# EAGLE board untitled (EAGLE 9.3.0)
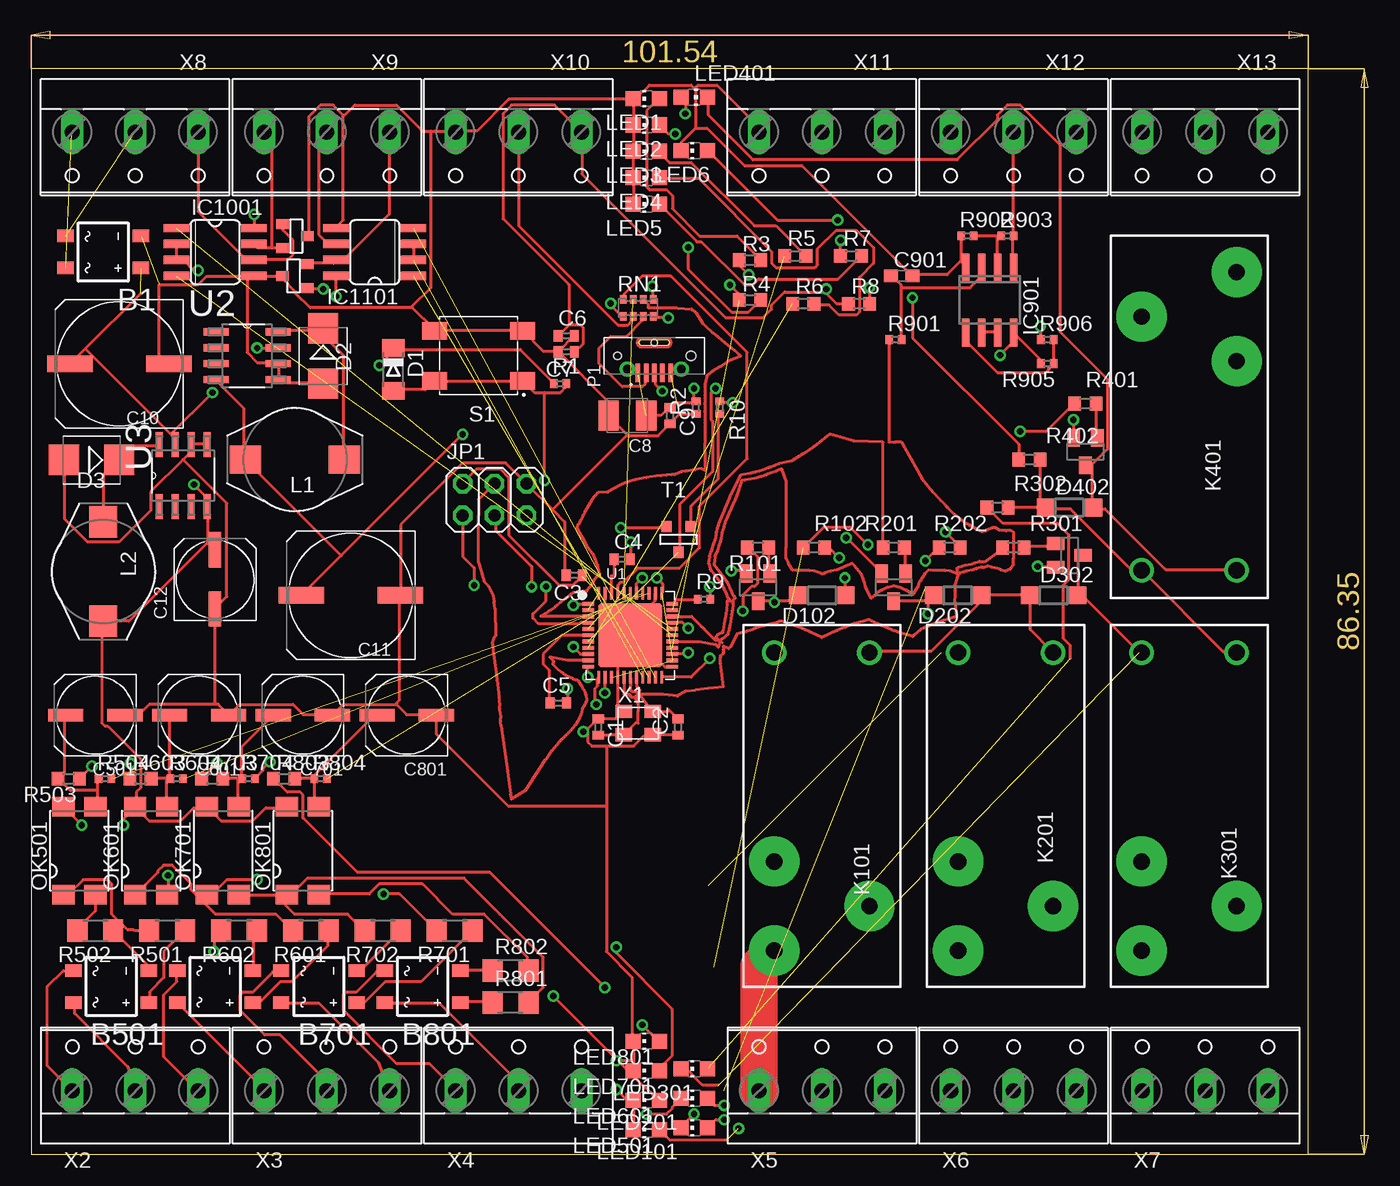
[diagram p8: board, top side]
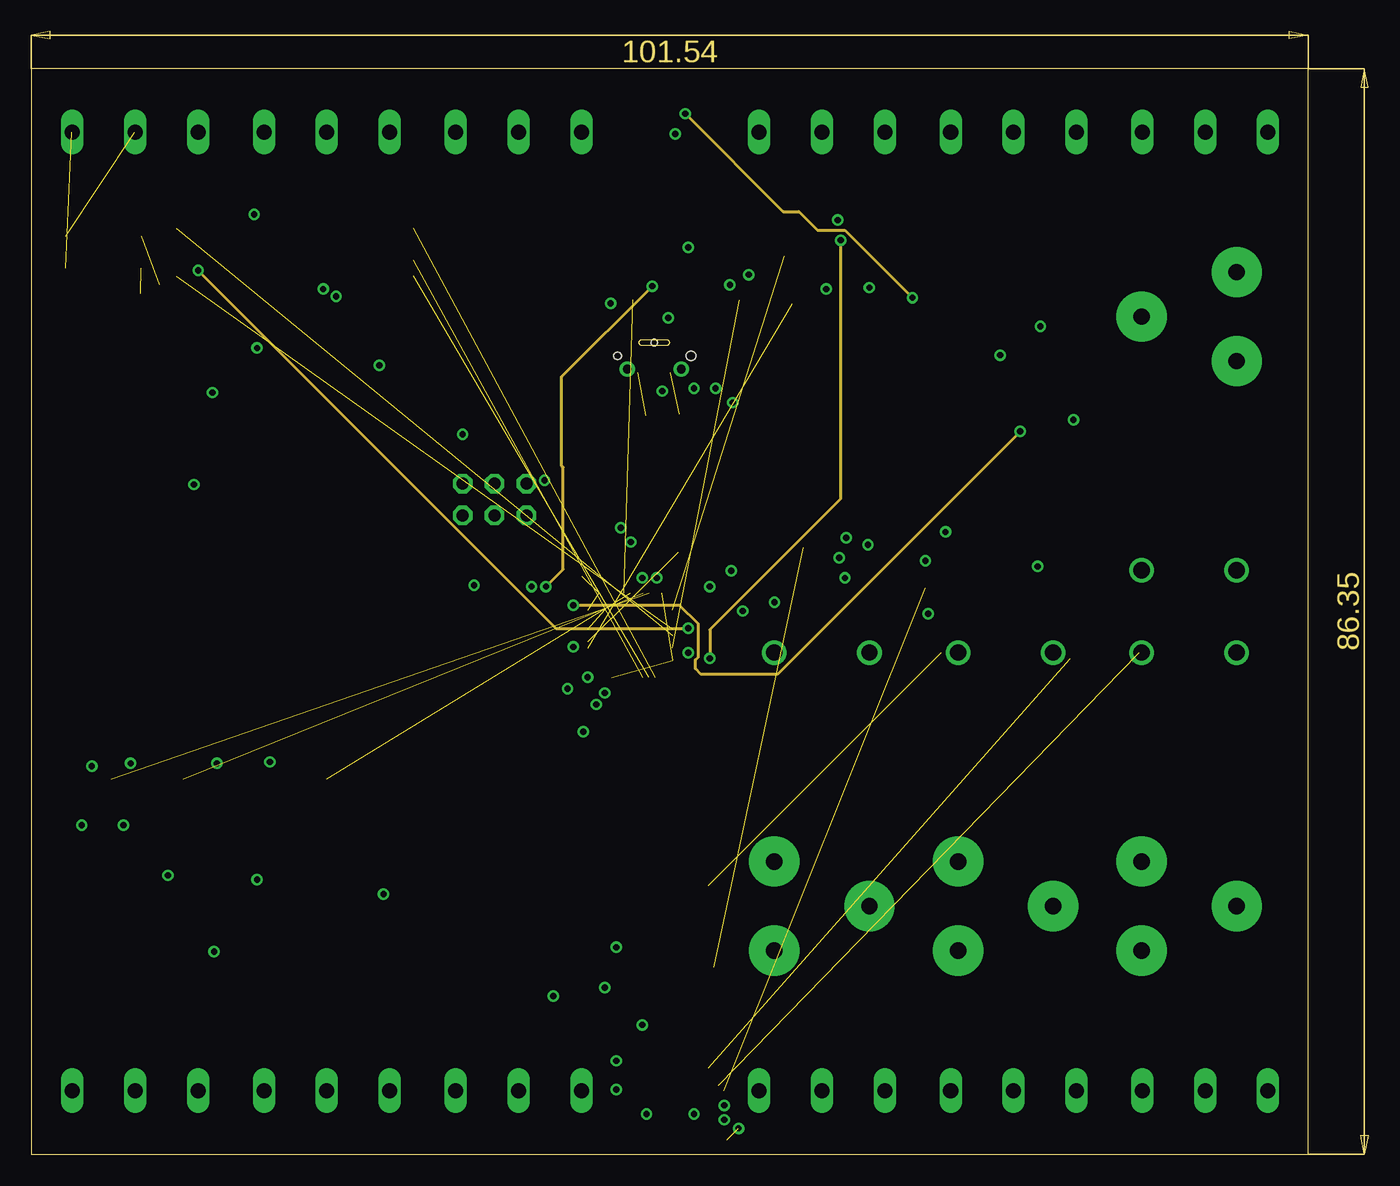
[diagram p9: board, inner layer Route2]
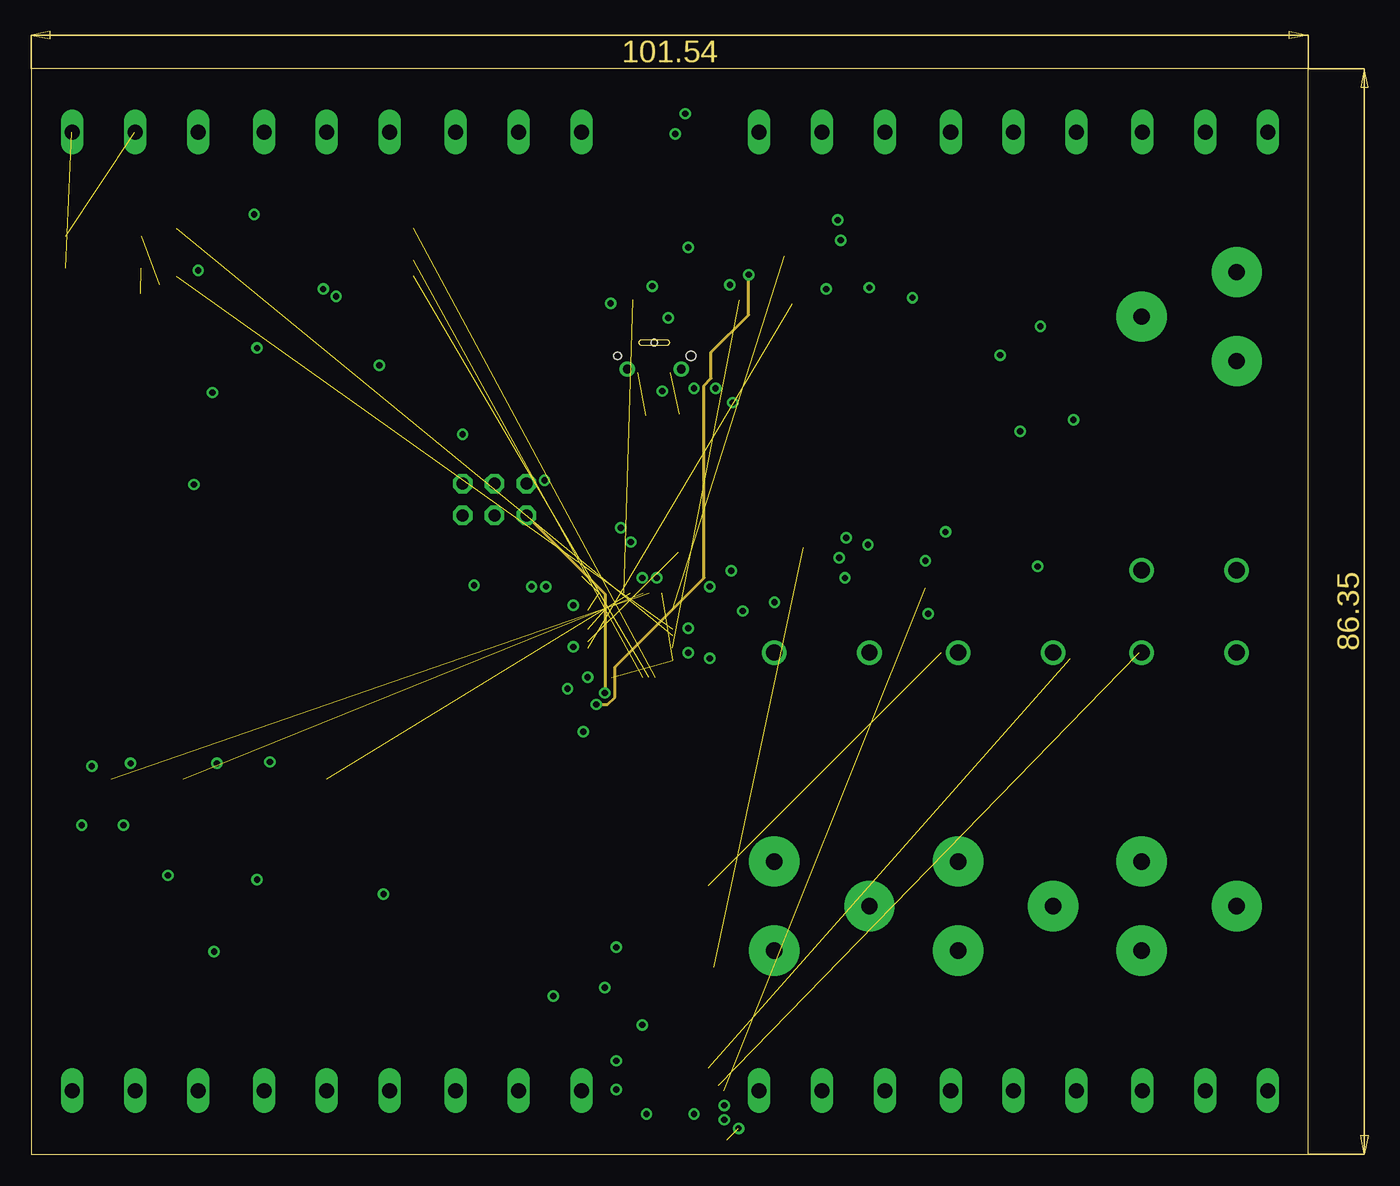
[diagram p10: board, inner layer Route15]
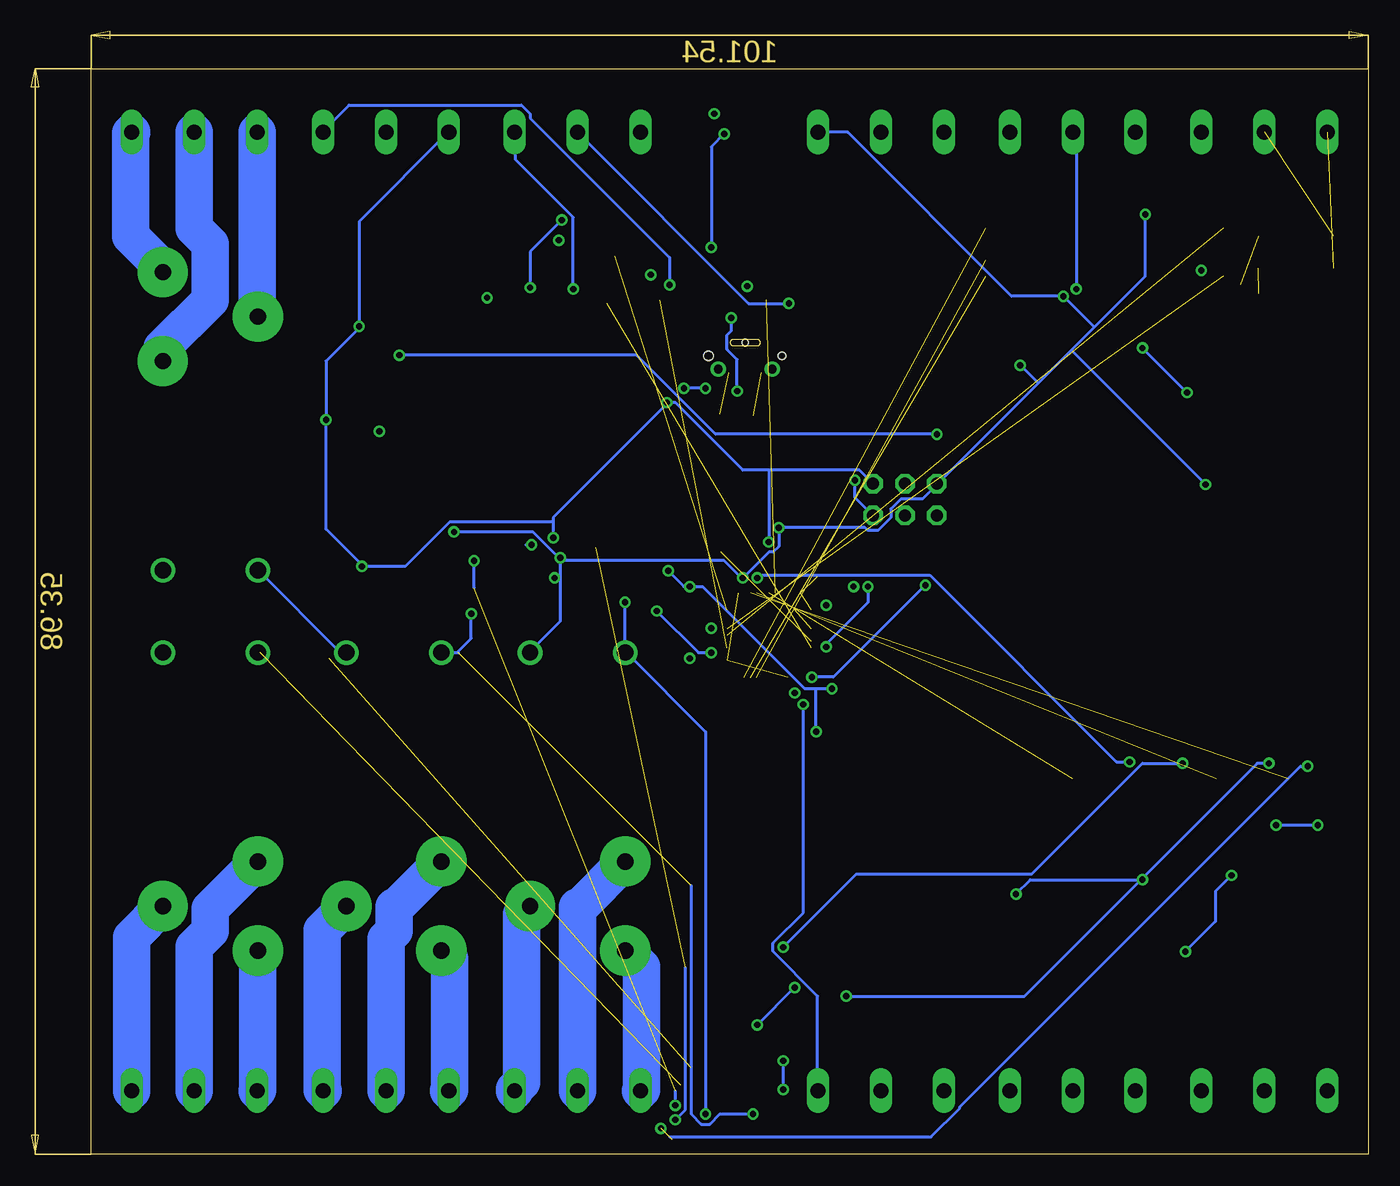
[diagram p11: board, bottom side, seen from below]

Size 101.54 x 86.35 mm. Coordinates in mm from the lower left corner, seen from the top.
Outline: 0,0 101.54,0 101.54,86.35 0,86.35 0,0
Copper layers (1+2*15+16): Top 0.035mm / dielectric 1.5mm / Route2 0.035mm / dielectric 0.15mm / Route15 0.035mm / dielectric 0.2mm / Bottom 0.035mm
Design rules "default *": minimum track width 6mil, minimum drill 0.35mm, track to track 6mil, track to pad 6mil, pad to pad 6mil, via to via 6mil, smd to smd 6mil, copper to edge 40mil, drill to drill 6mil, minimum pad ring 10mil, minimum via ring 8mil, stop-mask expansion 4mil, vias tented up to drill 0mil, thermal gap 10mil
Net classes: 0 default: width 0.254 mm, drill 0.5 mm, clearance 0.203 mm; 1 hipower: width 3 mm, drill 1 mm, clearance 0.254 mm; 2 power: width 0.508 mm, drill 0.013 mm, clearance 0.203 mm

## Footprints (pad centres in the part's own frame; a part is rotated, then mirrored left to right if it is on the bottom)
MBS = smd 1 x 1.3: + -1.27,-3; - 1.27,-3; AC1 -1.27,3; AC2 1.27,3
C0402 = smd 0.7 x 0.9: 1 -0.65,0; 2 0.65,0
SMC_B = smd 1.6 x 2.4: + -1.5,0; - 1.5,0
UD-10X10_NICHICON = smd 3.6 x 1.3: + 3.925,0; - -3.95,0
UD-6,3X5,8_NICHICON = smd 2.8 x 1: + 2.35,0; - -2.35,0
C0603 = smd 1.1 x 1: 1 -0.85,0; 2 0.85,0
MINIMELF = smd 1.4 x 1.8: A 1.7,0; C -1.7,0
SMB = smd 2.4 x 2.4: A 2.2,0; C -2.2,0
SOD123 = smd 1.4 x 1.4: A 1.9,0; C -1.9,0
SOT-23-3 = smd 0.802 x 0.972: 1 -0.95,-1; 2 0.95,-1; 3 0,1
SO08 = smd 0.6 x 2.2: 1 -1.905,-2.6; 2 -0.635,-2.6; 3 0.635,-2.6; 4 1.905,-2.6; 5 1.905,2.6; 6 0.635,2.6; 7 -0.635,2.6; 8 -1.905,2.6
SO08' = smd 0.66 x 2.032: 1 -1.905,-3.073; 2 -0.635,-3.073; 3 0.635,-3.073; 4 1.905,-3.073; 5 1.905,3.073; 6 0.635,3.073; 7 -0.635,3.073; 8 -1.905,3.073
2X03 = drill 0.95 pad 1.55 octagon: 1 -2.54,-1.27; 2 -2.54,1.27; 3 0,-1.27; 4 0,1.27; 5 2.54,-1.27; 6 2.54,1.27
RT-C/O12A3.5 = drill 1.3 pad 4: 11 7.56,3.78; 12 4.02,-3.78; 14 11.1,-3.78 | drill 1.3: A1 -12.6,-3.78; A2 -12.6,3.78
BOURNS_SRR0805 = smd 2.5 x 2.2: 1 -3.95,0; 2 3.95,0
CHIP-LED0805 = smd 1.2 x 1.2: A 0,-1.05; C 0,1.05
SMD4 = smd 1.78 x 1.55: 1 -1.27,-3.5; 2 1.27,-3.5; 3 1.27,3.5; 4 -1.27,3.5
KYCON_KMMVX-SMT-BS-BTR = smd 0.45 x 1.5: 1 -1.3,-1.35; 2 -0.65,-1.35; 3 0,-1.35; 4 0.65,-1.35; 5 1.3,-1.35 | drill 0.7 pad 1: P1 -2.15,-1.05; P2 2.15,-1.05 | smd 0.1 x 0.1: P3 -1.3,1.05 | hole 0.6: -2.925,0 | hole 0.75: 2.925,0 | hole 0.5: 0,1.05
BSS138L = smd 1 x 1.4: D 0,1.1; G -0.95,-1.1; S 0.95,-1.1
R0402 = smd 0.6 x 0.7: 1 -0.5,0; 2 0.5,0
R0603 = smd 1 x 1.1: 1 -0.85,0; 2 0.85,0
R1206 = smd 1.6 x 1.803: 1 -1.422,0; 2 1.422,0
CAY16 = smd 0.5 x 0.65: 1 -1.2,-0.675; 2 -0.4,-0.675; 3 0.4,-0.675; 4 1.2,-0.675; 5 1.2,0.675; 6 0.4,0.675; 7 -0.4,0.675; 8 -1.2,0.675
430481035816 = smd 2 x 1.4: 1 -3.5,2; 2 3.5,2; 3 -3.5,-2; 4 3.5,-2
SOT-23 = smd 0.787 x 0.889: 1 0.025,-1.016; 2 -0.94,1.016; 3 0.991,1.016
QFN44G-0.5-7X7MM = smd 1 x 0.3: 1 -3.35,2.5; 2 -3.35,2; 3 -3.35,1.5; 4 -3.35,1; 5 -3.35,0.5; 6 -3.35,0; 7 -3.35,-0.5; 8 -3.35,-1; 9 -3.35,-1.5; 10 -3.35,-2; 11 -3.35,-2.5; 23 3.35,-2.5; 24 3.35,-2; 25 3.35,-1.5; 26 3.35,-1; 27 3.35,-0.5; 28 3.35,0; 29 3.35,0.5; 30 3.35,1; 31 3.35,1.5; 32 3.35,2; 33 3.35,2.5 | smd 0.3 x 1: 12 -2.5,-3.35; 13 -2,-3.35; 14 -1.5,-3.35; 15 -1,-3.35; 16 -0.5,-3.35; 17 0,-3.35; 18 0.5,-3.35; 19 1,-3.35; 20 1.5,-3.35; 21 2,-3.35; 22 2.5,-3.35; 34 2.5,3.35; 35 2,3.35; 36 1.5,3.35; 37 1,3.35; 38 0.5,3.35; 39 0,3.35; 40 -0.5,3.35; 41 -1,3.35; 42 -1.5,3.35; 43 -2,3.35; 44 -2.5,3.35 | smd 5.08 x 5.08: TAB 0,0
SOIC127P620X175-8N = smd 1.981 x 0.559: 1 -2.464,1.905; 2 -2.464,0.635; 3 -2.464,-0.635; 4 -2.464,-1.905; 5 2.464,-1.905; 6 2.464,-0.635; 7 2.464,0.635; 8 2.464,1.905
CRYSTAL-3.2-2.5 = smd 1.3 x 1.05: 1 -1.15,-0.925; 2 1.15,-0.925; 3 1.15,0.925; 4 -1.15,0.925
W237-103 = drill 1.194 long: 1 -5,-1.29; 2 0,-1.29; 3 5,-1.29

## Placement (x,y rotation side)
B1  B6S  [MBS]  5.71,71.75 90 top
B501  B6S  [MBS]  6.35,13.34 90 top
B601  B6S  [MBS]  14.61,13.34 90 top
B701  B6S  [MBS]  22.86,13.34 90 top
B801  B6S  [MBS]  31.11,13.34 90 top
C1  22pF  [C0402]  45.07,33.98 270 top
C2  22pF  [C0402]  51.42,33.98 90 top
C3  1uF  [C0402]  43.16,46.05 180 top
C4  100n  [C0402]  46.98,47.31 0 top
C5  1uF  [C0402]  41.9,35.88 0 top
C6  100n  [C0402]  42.53,65.09 0 top
C7  100n  [C0402]  42.53,63.83 180 top
C8  22u  [SMC_B]  47.4,58.74 180 top
C9  100n  [C0402]  50.78,58.74 270 top
C10  220uFx35V  [UD-10X10_NICHICON]  6.99,62.87 180 top
C11  220uFx35V  [UD-10X10_NICHICON]  25.4,44.45 180 top
C12  220uFx10  [UD-6,3X5,8_NICHICON]  14.61,45.72 90 top
C501  100uFx6,3  [UD-6,3X5,8_NICHICON]  5.08,34.92 180 top
C601  100uFx6,3  [UD-6,3X5,8_NICHICON]  13.34,34.92 180 top
C701  100uFx6,3  [UD-6,3X5,8_NICHICON]  21.59,34.92 180 top
C801  100uFx6,3  [UD-6,3X5,8_NICHICON]  29.84,34.92 180 top
C901  0.1uF  [C0603]  69.22,69.85 0 top
D1  CD1206-S01575  [MINIMELF]  28.78,62.41 270 top
D2  MBRS130LT3  [SMB]  23.2,63.48 270 top
D3  MBRS130LT3  [SMB]  4.79,55.23 180 top
D102  MBR0520LT  [SOD123]  62.87,44.45 180 top
D202  MBR0520LT  [SOD123]  73.66,44.45 180 top
D302  MBR0520LT  [SOD123]  81.28,44.45 0 top
D402  MBR0520LT  [SOD123]  82.55,51.44 0 top
D1001  CDSOT23-SM712  [SOT-23-3]  20.95,73.03 270 top
D1101  CDSOT23-SM712  [SOT-23-3]  20.95,69.85 90 top
IC901  LM2904  [SO08]  76.2,67.94 180 top
IC1001  MAX481CSA  [SO08']  14.61,71.75 270 top
IC1101  MAX481CSA  [SO08']  27.3,71.75 90 top
JP1  3x2M  [2X03]  36.83,52.07 0 top
K101  RT174005  [RT-C/O12A3.5]  62.87,27.3 270 top
K201  RT174005  [RT-C/O12A3.5]  77.47,27.3 270 top
K301  RT174005  [RT-C/O12A3.5]  92.08,27.3 270 top
K401  RT174005  [RT-C/O12A3.5]  92.08,59.05 90 top
L1  DO3308P-334MLD  [BOURNS_SRR0805]  20.95,55.24 180 top
L2  DO3316-224  [BOURNS_SRR0805]  5.71,46.35 270 top
LED1  IN-S85AT5B  [CHIP-LED0805]  48.9,83.96 90 top
LED2  IN-S85AT5B  [CHIP-LED0805]  48.9,81.86 90 top
LED3  IN-S85AT5B  [CHIP-LED0805]  48.9,79.76 90 top
LED4  IN-S85AT5B  [CHIP-LED0805]  48.9,77.66 90 top
LED5  IN-S85AT5B  [CHIP-LED0805]  48.9,75.56 90 top
LED6  IN-S85AT5B  [CHIP-LED0805]  52.7,79.81 90 top
LED101  IN-S85AT5B  [CHIP-LED0805]  52.7,2.1 90 top
LED201  IN-S85AT5B  [CHIP-LED0805]  52.7,4.45 90 top
LED301  IN-S85AT5B  [CHIP-LED0805]  52.7,6.79 90 top
LED401  IN-S85AT5B  [CHIP-LED0805]  52.7,84.07 270 top
LED501  IN-S85AT5B  [CHIP-LED0805]  48.9,1.96 90 top
LED601  IN-S85AT5B  [CHIP-LED0805]  48.9,4.3 90 top
LED701  IN-S85AT5B  [CHIP-LED0805]  48.9,6.65 90 top
LED801  IN-S85AT5B  [CHIP-LED0805]  48.9,8.99 90 top
OK501  LTV816S  [SMD4]  3.81,24.13 0 top
OK601  LTV816S  [SMD4]  9.53,24.13 0 top
OK701  LTV816S  [SMD4]  15.24,24.13 0 top
OK801  LTV816S  [SMD4]  21.59,24.13 0 top
P1  KMMVX-SMT-BS-BTR  [KYCON_KMMVX-SMT-BS-BTR]  49.53,63.5 0 top
Q101  BSS138L  [BSS138L]  57.78,45.09 180 top
Q201  BSS138L  [BSS138L]  68.58,45.09 180 top
Q301  BSS138L  [BSS138L]  82.55,47.62 270 top
Q401  BSS138L  [BSS138L]  83.82,55.88 180 top
R1  10K  [R0402]  42.05,61.28 0 top
R2  10K  [R0402]  52.84,59.38 90 top
R3  600  [R0603]  57.15,71.12 0 top
R4  600  [R0603]  57.15,67.94 0 top
R5  600  [R0603]  60.74,71.44 0 top
R6  600  [R0603]  61.38,67.64 0 top
R7  600  [R0603]  65.19,71.44 0 top
R8  600  [R0603]  65.83,67.64 0 top
R9  10K  [R0402]  53.48,44.14 0 top
R10  10K  [R0402]  54.74,59.38 270 top
R101  1K  [R0603]  57.78,48.26 0 top
R102  600  [R0603]  62.23,48.26 0 top
R201  1K  [R0603]  68.58,48.26 0 top
R202  600  [R0603]  73.03,48.26 0 top
R301  1K  [R0603]  78.11,48.26 0 top
R302  600  [R0603]  76.83,51.44 0 top
R401  1K  [R0603]  83.82,59.69 0 top
R402  600  [R0603]  79.38,55.24 0 top
R501  82K  [R1206]  10.79,17.78 180 top
R502  82K  [R1206]  5.08,17.78 180 top
R503  600  [R0603]  2.96,29.86 180 top
R504  10K  [R0402]  5.85,29.86 0 top
R601  82K  [R1206]  22.23,17.78 180 top
R602  82K  [R1206]  16.51,17.78 180 top
R603  600  [R0603]  8.68,29.86 0 top
R604  10K  [R0402]  11.56,29.86 0 top
R701  82K  [R1206]  33.66,17.78 180 top
R702  82K  [R1206]  27.94,17.78 180 top
R703  600  [R0603]  14.39,29.86 0 top
R704  10K  [R0402]  17.28,29.86 0 top
R801  82K  [R1206]  38.1,12.06 0 top
R802  82K  [R1206]  38.1,14.61 0 top
R803  600  [R0603]  20.11,29.86 0 top
R804  10K  [R0402]  23,29.86 0 top
R901  10k  [R0402]  68.72,64.79 0 top
R902  4.7k  [R0402]  74.43,73.05 0 top
R903  4.7k  [R0402]  77.61,73.05 0 top
R905  4.7k  [R0402]  80.78,62.88 180 top
R906  4.7k  [R0402]  80.78,64.79 0 top
RN1  22R  [CAY16]  48.26,67.31 180 top
S1  430481035816_430481035816  [430481035816]  35.56,63.5 180 top
T1  FDN340P/PMV48XP  [SOT-23]  51.44,48.9 0 top
U1  MCU-ATMEGA32U4-MUR(VQFN44)  [QFN44G-0.5-7X7MM]  47.62,41.27 0 top
U2  LM2594M-12  [SOIC127P620X175-8N]  17.14,63.5 0 top
U3  LM2594M-05  [SOIC127P620X175-8N]  12.06,53.98 90 top
X1  16MHz KX-7  [CRYSTAL-3.2-2.5]  48.26,34.29 0 top
X2  [W237-103]  8.26,6.35 0 top
X3  [W237-103]  23.5,6.35 0 top
X4  [W237-103]  38.73,6.35 0 top
X5  [W237-103]  62.87,6.35 0 top
X6  [W237-103]  78.11,6.35 0 top
X7  [W237-103]  93.34,6.35 0 top
X8  [W237-103]  8.26,80.01 180 top
X9  [W237-103]  23.5,80.01 180 top
X10  [W237-103]  38.73,80.01 180 top
X11  [W237-103]  62.87,80.01 180 top
X12  [W237-103]  78.11,80.01 180 top
X13  [W237-103]  93.34,80.01 180 top

## Tracks (layer width: path | path; a pad name or v marks a point on that pad's centre or on a via)
0-10V1:N$1
  Top 0.254: R906.2 81.27,64.69 81.27,62.98 R905.1 81.27,62.87 80.92,62.52 80.92,62.41 80.7,62.18 76.81,62.18 74.3,64.69 IC901.5
0-10V1:N$2
  Top 0.254: 69.15,68.92 69.15,69.15 68.47,69.84 C901.1 | 69.15,68.92 69.15,64.81 R901.2 | 69.15,68.92 74.64,68.92 75.55,69.84 75.55,70.52 IC901.3
0-10V1:N$3
  Top 0.254: IC901.6 75.67,65.38 76.81,65.38 IC901.7
0-10V1:N$4
  Top 0.254: R902.2 74.98,73.04 77.04,73.04 R903.1 76.81,72.92 76.81,70.64 IC901.2
10V1
  Top 0.254: IC901.1 78.07,70.64 78.07,73.04 R903.2 78.07,73.15 78.07,81.27 X12.2
24V1  (1 unrouted)
  Top 0.254: 3.2,81.27 X8.3
24V2  (1 unrouted)
  Top 0.254: 8.23,81.27 X8.2
+5V  (via drill 0.5)  (4 unrouted)
  Top 0.254: v64.24,47.43 63.44,48.23 63.09,48.23 R102.2 | v72.69,49.49 73.84,48.35 R202.2 | v64.69,45.83 64.69,44.46 D102.C | K201.A2 81.15,40.01 79.44,41.72 79.44,44.35 D302.C 79.32,44.46 75.67,44.46 D202.C 75.55,44.35 75.55,44.01 71.55,40.01 66.75,40.01 K101.A2 | D402.C R302.2 | R402.2 80.24,55.21 80.24,51.55 D402.C | D402.C 80.7,51.32 82.64,51.32 87.44,46.52 88.24,46.52 K401.A2 88.35,46.41 94.75,40.01 95.78,40.01 K301.A2 | 42.75,65.95 41.95,65.15 C6.1 | 42.75,65.95 43.66,65.95 43.89,65.72 43.89,64.47 43.2,63.78 C7.1 | 63.09,68.58 64.01,67.67 64.92,67.67 R8.1 | 63.09,68.58 59.89,68.58 58.86,67.55 58.86,67.21 58.18,66.52 55.21,66.52 43.78,77.95 43.78,81.27 X10.1 43.66,81.38 41.6,83.44 38.18,83.44 37.49,82.75 37.49,74.41 42.75,69.15 42.75,65.95 | v63.21,68.81 63.09,68.69 63.09,68.58 | v4,26.18 2.63,27.55 OK501.4 | v7.32,26.18 7.32,26.63 8.23,27.55 OK601.4 | OK601.4 8.34,27.55 9.37,26.52 11.89,26.52 12.92,27.55 13.95,27.55 OK701.4 14.06,27.55 15.09,26.52 17.6,26.52 18.63,27.55 20.23,27.55 OK801.4 | 14.06,48.58 14.06,51.44 U3.4 13.95,51.55 13.95,52.23 v12.92,53.26 | 14.06,48.58 14.52,48.12 C12.+ | L2.2 7.77,42.41 13.95,48.58 14.06,48.58 | L2.2 | OK601.4 8.34,27.66 8.34,28.8 8.69,29.15 8.69,31.43 6.06,34.06 5.83,34.06 5.6,34.29 5.6,42.41 L2.2 | R1.1 41.49,61.38 38.86,64.01 28.8,64.01 D1.C 28.8,63.89 v27.66,62.75 | v46.86,49.84 50.41,49.84 T1.2 | C3.1 43.78,45.95 43.09,45.26 41.95,45.26 37.95,49.26 37.95,53.84 37.26,54.52 35.43,54.52 34.29,53.38 JP1.2 | v49.72,45.83 50.18,45.38 50.18,44.69 U1.34 | v17.72,74.75 17.72,73.72 IC1001.8 | v24.23,68.24 IC1101.8
  Bottom 0.254: 64.24,45.83 64.24,42.41 66.64,40.01 K101.A2 | 64.24,45.83 v64.24,47.43 | v72.69,49.49 66.41,49.49 64.35,47.43 v64.24,47.43 | 64.24,45.83 v64.69,45.83 | K201.A2 81.27,40.01 81.84,40.01 88.24,46.41 K401.A2 | v63.21,68.81 63.21,74.52 67.78,79.1 67.78,81.27 X11.1 | v7.32,26.18 v4,26.18 | v17.72,74.75 17.72,69.84 21.77,65.78 | 26.23,61.32 34.18,53.38 JP1.2 34.29,53.26 35.43,52.12 37.15,52.12 37.95,51.32 37.95,50.63 38.98,49.61 39.78,49.61 40.01,49.84 v46.86,49.84 46.86,48.35 47.32,47.89 47.66,47.89 v49.72,45.83 49.84,45.83 51.21,47.21 64.12,47.21 v64.24,47.43 | 26.23,61.32 23.6,63.95 | 23.6,63.95 21.77,65.78 | 21.77,65.78 v24.23,68.24 28.35,68.24 41.38,81.27 43.66,81.27 X10.1 | 26.23,61.32 v27.66,62.75 | 23.6,63.95 v12.92,53.26
+12V  (via drill 0.5)
  Top 0.254: U2.4 14.74,61.49 16.92,59.32 16.92,55.32 L1.2 17.03,55.21 24.63,47.61 | 78.47,64.98 78.18,65.27 IC901.8 | 78.47,64.98 80.24,63.21 80.24,62.98 R905.2 | v77.04,63.55 78.47,64.98 | 24.63,47.61 21.49,44.46 C11.+ | 24.63,47.61 v34.29,57.26
  Bottom 0.254: v77.04,63.55 58.18,63.55 51.89,57.26 v34.29,57.26
A0/S1  (1 unrouted)
A1/S2  (1 unrouted)
A2/S3  (via drill 0.5)
  Top 0.254: v18.97,31.2 18.4,30.63 18.4,30.52 17.83,29.95 R704.2 | v48.58,45.83 48.12,45.38 48.12,44.69 U1.38
  Bottom 0.254: v18.97,31.2 20,31.2 34.86,46.06 48.35,46.06 v48.58,45.83
A3/S4  (1 unrouted)
A4  (1 unrouted)
A4O
  Top 0.254: RN1.6 47.78,66.52 47.78,66.29 47.43,65.95 46.63,65.95 38.75,73.84 38.75,81.27 X10.2
A5
  Top 0.254: RN1.4 47.09,68.01 47.09,68.35 48.58,69.84 50.86,69.84 56.92,63.78 56.92,55.32 53.15,51.55 53.15,48.23 51.55,46.63 48.23,46.63 47.09,45.49 46.86,45.49 46.63,45.26 46.63,44.69 U1.41
A5O  (via drill 0.5)
  Top 0.254: v46.06,67.67 46.06,67.55 46.98,66.64 RN1.5
  Bottom 0.254: v46.06,67.67 49.26,67.67 62.87,81.27 X11.2
AREF
  Top 0.254: C4.1 46.33,45.99 46.25,45.99 46.12,45.99 U1.42
D0/RX/RS485R2  (1 unrouted)
D1/TX/RS485D2  (1 unrouted)
D2/SDA/RS485REDE2  (1 unrouted)
  Top 0.254: IC1101.2 30.4,71.21 30.4,72.35 IC1101.3
D3/SCL/PWM
  Top 0.254: R901.1 68.22,56.62 68.58,56.62 68.72,56.62 69.2,56.62 69.43,56.19 70.8,53.73 71.67,52.68 72.17,52.13 72.31,51.98 72.67,51.62 72.85,51.44 73.03,51.24 73.38,50.92 73.41,50.88 73.88,50.53 74.38,50.14 74.58,50.03 75.28,49.66 75.56,49.51 75.89,49.62 75.98,49.65 76.48,49.83 76.66,49.85 76.99,49.63 77.17,49.62 77.22,49.62 77.47,49.62 77.58,49.62 77.72,49.62 77.75,49.62 77.91,49.6 78.11,49.46 78.11,49.11 78.11,48.26 78.11,47.41 78.11,46.9 77.85,46.54 77.67,46.48 77.6,46.45 77.5,46.4 77.46,46.39 77.42,46.4 77.37,46.42 77.35,46.42 77.08,46.52 76.81,46.6 76.32,46.7 76.03,46.79 75.64,46.68 75.62,46.69 75.56,46.71 75.56,46.7 75.51,46.69 75.49,46.68 75.16,46.57 74.86,46.48 74.38,46.38 74.12,46.3 73.86,46.21 73.84,46.21 73.77,46.19 73.74,46.17 73.43,45.3 73.43,44.88 73.43,44.19 73.43,43.94 73.58,42.78 73.39,42.71 73.22,42.65 72.39,42.41 72.02,42.28 71.84,42.21 71.66,42.13 71.64,42.13 71.29,41.98 70.97,41.84 70.72,41.72 70.19,41.3 70.09,41.17 68.93,41.5 68.85,41.54 68.58,41.66 68.45,41.71 67.05,42.3 66.95,42.35 66.64,42.52 66.6,42.54 66.24,42.42 65.47,42.21 65.05,42.07 64.77,41.95 64.65,41.9 64.06,41.66 62.87,41.09 61.48,41.73 61.08,41.9 60.97,41.95 60.68,42.07 60.27,42.21 59.54,42.41 59.49,42.38 59.41,42.36 59.09,42.25 58.68,42.12 58.28,42.05 57.78,41.91 57.69,41.88 57.28,41.71 56.85,41.56 56.12,41.36 55.59,40.37 55.45,40.21 55.02,40.39 55.02,40.33 55.02,40.15 55.02,40.09 55.02,39.97 55.02,39.94 55.02,39.84 55.02,39.81 54.79,39.65 54.79,39.52 54.8,39.27 54.81,39.02 54.83,38.77 55.04,37.18 53.84,37.05 52.81,36.94 52.05,36.85 51.87,36.73 51.51,36.54 51.42,36.49 51.34,36.45 50.71,36.52 50.25,36.57 50.12,36.58 50.06,36.58 50,36.58 49.88,36.59 49.75,36.58 49.62,36.58 49.5,36.58 49.41,36.59 49.38,36.59 49.25,36.58 49.12,36.58 49,36.58 48.88,36.59 48.76,36.58 48.75,36.58 48.62,36.57 48.5,36.56 48.38,36.54 48.32,36.53 48.38,36.95 48.37,36.95 48.29,36.97 48.12,37.23 U1.18
D4/R1  (via drill 0.5)
  Top 0.254: v52.23,39.89 52.12,39.78 U1.25 | v56.58,43.2 56.58,44.46 57.26,45.15 57.49,45.15 57.72,45.38 57.72,47.55 57.04,48.23 R101.1
  Bottom 0.254: v52.23,39.89 53.26,39.89 v56.58,43.2
D5/R2
  Top 0.254: 56.4,54.01 55.67,52.61 54.74,50.43 54.73,50.38 54.66,50.16 54.63,50.07 54.54,49.76 54.46,49.52 54.35,48.87 54.26,48.61 54.13,48.22 54.11,48.16 54.04,47.94 53.99,47.8 53.97,47.75 53.92,47.58 53.87,47.2 53.84,47.01 54,46.5 54.1,46.4 54.23,46.23 54.62,45.7 54.87,45.37 54.9,45.3 55.08,44.94 55.14,44.8 55.27,44.53 55.34,44.38 55.45,44.2 55.56,44.01 55.57,44 55.32,44.04 55.32,44.01 55.32,43.89 55.32,43.81 55.28,43.34 55.22,42.97 55.09,42.16 55.05,41.95 54.99,41.61 54.97,41.49 54.58,41.29 54.43,41.13 54.93,40.69 54.93,40.7 54.79,40.82 54.72,40.88 54.37,40.9 54.24,41.02 53.99,41.27 53.98,41.29 53.74,41.52 53.5,41.77 53.48,41.8 53.24,42.02 52.99,42.27 52.98,42.29 52.73,42.52 52.62,42.65 52.51,42.77 U1.31 | R201.1 67.73,56.63 65.41,56.72 63.45,57.26 63.08,56.97 62.23,56.29 61.88,56.05 61.38,55.73 60.88,55.41 60.44,55.15 59.48,54.92 59.05,54.74 59.04,54.74 58.79,54.65 58.67,54.61 58.31,54.47 58.06,54.38 57.89,54.33 57.56,54.24 57.39,54.2 57.14,54.15 56.64,54.06 56.4,54.01 | 56.4,54.01
D6/R3
  Top 0.254: R301.1 76.96,47.97 75.78,47.12 75.76,47.12 75.42,47.14 75.37,47.12 75.34,47.12 75.02,47.01 74.75,46.92 74.26,46.83 73.98,46.74 73.72,46.65 73.7,46.64 73.63,46.62 73.59,46.61 73.59,46.18 73.52,46.21 73.38,46.27 73.03,46.39 72.67,46.42 72.46,46.43 72.17,46.43 71.76,46.43 71.67,46.43 71.33,46.45 71.06,46.19 71.06,46.18 70.65,45.56 70.6,45.48 70.51,45.21 70.49,45.15 70.07,44.5 69.88,44.69 69.53,44.86 69.48,44.88 69.08,45.09 69.03,45.09 68.58,45.21 68.13,45.09 68.08,45.09 67.68,44.88 67.63,44.86 67.28,44.69 67.13,44.53 66.77,44.23 66.67,44.45 66.42,44.97 66.33,45.15 66.26,45.48 66.13,45.82 66,46.15 65.97,46.19 65.47,46.81 65.28,47 64.77,46.77 64.62,46.72 64.06,46.48 63.58,46.38 63.08,46.22 63.02,46.2 62.87,46.15 62.72,46.21 62.58,46.27 62.23,46.39 61.88,46.42 61.66,46.43 61.38,46.43 60.97,46.43 60.88,46.43 60.54,46.45 60.26,46.88 60.18,47.06 60.01,47.4 60.01,48.26 60.01,49.63 60.01,53.52 59.66,54.5 59.22,54.32 59.2,54.31 58.95,54.22 58.83,54.18 58.46,54.04 58.21,53.95 58.03,53.9 57.66,53.8 57.48,53.75 57.23,53.7 56.73,53.61 56.47,53.56 56.46,53.56 56.09,52.43 55.17,50.28 55.16,50.24 55.09,50.02 55.07,49.93 54.97,49.62 54.91,49.41 54.79,48.75 54.69,48.46 54.56,48.07 54.54,48.02 54.47,47.8 54.41,47.62 54.38,47.55 54.38,47.6 54.38,47.59 54.32,47.15 54.3,46.95 54.32,46.83 54.45,46.7 54.59,46.5 54.99,45.97 55.26,45.6 55.31,45.5 55.49,45.14 55.55,45 55.69,44.73 55.75,44.6 55.84,44.43 55.95,44.24 55.96,44.23 55.78,44.04 55.78,44.01 55.78,43.89 55.78,43.79 55.74,43.28 55.67,42.9 55.54,42.09 55.5,41.88 55.45,41.54 55.42,41.41 54.92,40.99 54.77,40.82 54.64,40.34 54.63,40.34 54.48,40.48 54.42,40.54 53.13,40.77 U1.27
D7/R4  (via drill 0.5)
  Top 0.254: v43.09,43.66 43.2,43.78 44.23,43.78 U1.1 | v78.64,57.49 80.7,57.49 82.87,59.66 R401.1
  Route2 0.254: v43.09,43.66 51.55,43.66 53.03,42.18 53.03,39.55 52.81,39.32 52.81,38.63 53.26,38.18 59.32,38.18 v78.64,57.49
D+  (via drill 0.5)
  Top 0.254: v50.63,66.52 49.49,66.52 RN1.8 | v50.18,60.69 49.61,61.27 49.61,62.06 P1.3
  Bottom 0.254: v50.63,66.52 50.63,65.49 50.98,65.15 50.98,64.01 50.18,63.21 v50.18,60.69
D-
  Top 0.254: RN1.7 48.58,66.52 48.58,66.29 47.32,65.04 46.06,65.04 45.15,64.12 45.15,62.87 46.98,61.04 48.58,61.04 48.81,61.27 48.81,62.06 P1.2
GND  (via drill 0.5)  (3 unrouted)
  Top 0.254: U3.5 13.95,56.46 12.8,56.46 U3.6 12.69,56.35 12.69,55.89 12.06,55.26 | 12.06,55.26 9.49,52.69 9.49,51.21 6.97,48.69 4.46,48.69 2.63,50.52 2.63,55.21 D3.A | 14.63,35.78 14.86,35.78 15.66,34.98 C601.- 15.77,34.98 16.57,35.78 20.8,35.78 21.6,34.98 23.89,34.98 C701.- 24,34.98 24.8,35.78 29.03,35.78 | 14.63,35.78 9.37,35.78 8.57,34.98 7.54,34.98 C501.- | 29.03,35.78 29.83,34.98 32.12,34.98 C801.- 32.23,34.86 32.23,33.38 37.95,27.66 45.72,27.66 | 14.63,35.78 14.63,43.32 C12.- 14.63,43.43 15.54,44.35 15.54,51.78 12.06,55.26 | 29.03,35.78 29.03,35.89 29.26,36.12 29.26,44.35 C11.- 29.38,44.58 29.38,50.06 34.29,54.98 37.72,54.98 39.32,53.38 JP1.6 39.43,53.26 41.43,51.26 | v53.95,45.15 53.95,44.23 R9.2 | v55.66,46.41 56.69,46.41 56.81,46.29 Q101.S | v42.63,37.03 42.63,35.89 C5.2 | U1.43 45.61,44.58 45.61,43.32 47.55,41.38 U1.TAB | U1.23 50.86,38.75 50.41,38.75 48.01,41.15 47.66,41.15 U1.TAB | U1.35 49.61,44.58 49.61,44.01 47.32,41.72 U1.TAB | LED501.C 47.89,2.06 47.89,4.23 LED601.C 47.78,4.34 47.32,4.34 v46.52,5.14 | 47.89,7.43 47.89,8.91 LED801.C 47.78,9.03 47.78,14.06 45.72,16.12 45.72,27.66 | 47.89,7.43 47.89,6.74 LED701.C | 47.89,7.43 v46.52,7.43 | C2.1 51.32,33.38 49.49,33.38 X1.2 49.38,33.26 48.69,33.26 47.89,32.46 45.72,32.46 | 45.72,32.46 44.58,32.46 44.23,32.8 44.23,33.6 | 44.23,33.6 44.23,33.83 45.03,34.63 C1.1 45.15,34.63 46.52,34.63 47.09,35.2 X1.4 47.09,35.32 46.63,35.78 46.63,37.83 U1.15 46.63,37.95 46.63,38.75 48.46,40.58 U1.TAB | 45.72,32.46 45.72,27.66 | 44.23,33.6 v43.89,33.6 | 24.8,82.64 24,83.44 22.97,83.44 22.06,82.53 22.06,73.04 D1001.3
  Top 0.254: 24.8,82.64 24.8,74.3 24.23,73.72 IC1101.5 | 31.77,81.38 31.09,81.38 29.03,83.44 25.72,83.44 24.92,82.64 24.8,82.64 | 31.77,81.38 33.72,81.38 X10.3 33.83,81.38 35.43,81.38 37.95,83.9 47.78,83.9 LED1.C | 73.95,70.98 73.95,73.04 R902.1 | 73.95,70.98 74.3,70.64 IC901.4 | 73.95,70.98 73.84,70.98 72.81,69.95 70.07,69.95 C901.2 69.95,69.95 61.27,78.64 56.69,78.64 53.72,81.61 52.81,81.61 | LED5.C 47.89,75.67 47.89,77.61 LED4.C 47.89,77.72 47.89,79.67 LED3.C 47.89,79.78 47.89,81.84 LED2.C 47.89,81.95 47.89,83.9 LED1.C | 52.81,81.61 51.66,80.47 51.66,79.9 LED6.C | 52.81,84.7 52.81,81.61 | 52.81,84.7 52.46,85.04 49.15,85.04 48.01,83.9 LED1.C | X11.3 57.84,81.38 57.84,81.72 54.52,85.04 53.03,85.04 52.81,84.81 52.81,84.7 | D2.A 23.09,61.38 20,61.38 19.77,61.61 U2.5 19.66,61.61 19.66,62.87 U2.6 19.55,62.98 17.95,62.98 17.14,63.78 17.14,69.72 IC1001.5 | IC1001.5 17.72,69.84 19.89,69.84 D1101.3 19.89,69.72 21.03,68.58 21.03,68.47 22.17,67.32 30.29,67.32 | C10.- 10.86,62.87 10.17,63.55 10.17,69.15 13.26,69.15 13.95,69.84 17.6,69.84 IC1001.5 | R2.1 52.81,58.86 51.55,58.86 50.86,58.18 C9.2 50.75,58.06 49.84,57.15 47.43,57.15 | 47.43,57.15 45.95,58.64 C8.- 45.83,58.75 45.83,59.89 41.95,63.78 C7.2 | C7.2 41.95,63.89 43.09,65.04 C6.2 | C7.2 41.83,63.89 40.69,63.89 39.09,65.49 S1.3 38.98,65.49 32.12,65.49 S1.4 32,65.61 30.29,67.32 | v80.24,65.84 80.24,64.81 R906.1 | v82.87,58.41 82.87,57.04 Q401.S | v55.78,59.78 54.75,59.78 R10.1 | 41.43,51.26 42.41,50.29 42.41,46.06 C3.2 | v47.66,48.69 47.66,47.32 C4.2 | v64.81,49.03 67.55,46.29 Q201.S | v80.01,46.75 81.38,46.75 Q301.S
  Top 0.254: 41.43,51.26 47.32,57.15 47.43,57.15 | 31.77,81.38 31.77,68.92 30.29,67.44 30.29,67.32
  Bottom 0.254: v55.66,46.41 54.41,45.15 v53.95,45.15 52.92,45.15 44.81,37.03 43.89,37.03 | 43.89,37.03 v42.63,37.03 | v46.52,7.43 v46.52,5.14 | v43.89,33.6 43.89,37.03 | X12.3 73.15,81.27 80.24,74.18 v80.24,65.84 80.24,65.72 82.87,63.09 v82.87,58.41 82.87,49.72 80.01,46.86 v80.01,46.75 76.58,46.75 73.04,50.29 64.81,50.29 | 47.66,54.41 40.46,54.41 39.43,53.38 JP1.6 | 47.66,54.41 49.72,54.41 55.09,59.78 v55.78,59.78 55.78,59.66 64.81,50.63 64.81,50.29 | 47.66,54.41 v47.66,48.69 | 64.81,50.29 v64.81,49.03
HWB
  Top 0.254: R9.1 52.92,44.12 51.32,44.12 U1.33
IO8/RS485R1  (1 unrouted)
IO9/RS485D1  (1 unrouted)
IO10/RS485REDE1  (via drill 0.5)
  Top 0.254: v52.23,41.83 51.78,42.29 50.98,42.29 U1.30 | v13.26,70.29 12.92,70.29 12.12,71.09 11.54,71.09 IC1001.3 11.54,71.21 11.54,72.35 IC1001.2
  Route2 0.254: v52.23,41.83 41.72,41.83 v13.26,70.29
IO11  (via drill 0.5)
  Top 0.254: v44.92,35.78 44.81,35.89 44.81,37.03 45.03,37.26 45.03,37.83 U1.12 | v57.04,69.95 56.35,70.64 56.35,71.09 R3.1
  Route15 0.254: v57.04,69.95 57.04,66.75 54.06,63.78 54.06,61.72 53.49,61.15 53.49,45.83 46.41,38.75 46.41,36.35 45.83,35.78 v44.92,35.78
  Bottom 0.254: v44.92,35.78 44.92,19.2 47.32,16.8 47.32,16.12 43.78,12.57 43.78,5.14 X4.3
IO12  (via drill 0.5)  (1 unrouted)
  Top 0.254: v55.55,69.15 56.24,68.47 56.24,68.01 R4.1
  Bottom 0.254: v55.55,69.15 55.55,71.32 66.64,82.41 66.64,82.75 67.32,83.44 81.04,83.44 83.1,81.38 X12.1
IO13  (1 unrouted)
MISO  (via drill 0.5)
  Top 0.254: v44.23,37.95 44.23,38.75 U1.11 | v35.2,45.26 35.2,46.63 34.29,47.55 JP1.1
  Bottom 0.254: v44.23,37.95 42.52,37.95 v35.2,45.26
MOSI
  Top 0.254: JP1.4 35.56,52.07 35.56,50.8 35.56,49.53 35.56,47.05 36.02,45.53 36.3,45.23 36.72,44.45 36.8,43.91 36.89,43.37 36.9,41.21 36.76,41.03 36.65,40.66 36.66,40.55 36.73,39.99 36.76,39.76 37.02,37.71 37.19,36.34 37.2,36.11 37.23,35.66 37.24,35.44 37.24,35.42 37.26,35.17 37.3,34.67 37.31,34.42 37.36,34.07 37.87,30.44 37.96,29.75 38.11,28.65 38.17,28.24 39.29,28.95 40.9,31.38 41.07,31.62 41.42,32.1 41.59,32.34 41.74,32.53 42.2,33.02 42.36,33.18 42.53,33.34 42.54,33.35 42.7,33.52 42.86,33.67 43.27,34.13 43.37,34.28 43.45,34.45 43.55,34.67 43.58,34.72 43.66,34.9 43.7,34.98 43.82,35.44 43.89,35.58 43.99,35.77 44.01,35.81 44.1,35.99 44.15,36.09 44.12,36.54 44.05,36.66 43.9,36.97 43.85,37.05 43.77,37.19 43.75,37.24 43.47,37.68 43.32,37.74 43.03,37.85 42.91,37.9 42.79,37.96 42.48,38.13 42.31,38.23 42.17,38.32 41.77,38.67 41.63,38.8 41.47,38.96 41.45,38.98 41.53,39.23 41.49,39.27 41.28,39.48 41.22,39.54 42.66,39.27 U1.10
N$1  (via drill 0.5)  (1 unrouted)
  Top 0.254: 4.29,64.06 3.09,62.87 C10.+ | 4.29,64.06 8.69,68.47 | U3.7 11.43,56.92 11.09,57.26 | 4.29,64.06 11.09,57.26 | v17.95,64.12 19.55,64.12 U2.7 | 11.09,57.26 v14.4,60.58
  Bottom 0.254: v14.4,60.58 v17.95,64.12
N$2
  Top 0.254: U2.8 19.66,65.49 22.97,65.49 23.09,65.61 D2.C 22.97,65.38 24.8,63.55 24.8,55.32 L1.1
N$4
  Top 0.254: R5.2 61.49,71.55 59.21,73.84 57.49,73.84 52.46,78.87 50.75,78.87 49.95,79.67 LED3.A
N$5
  Top 0.254: R6.2 62.29,67.55 63.44,67.55 64.24,66.75 65.61,66.75 65.84,66.98 65.84,69.72 66.98,70.87 66.98,72.12 65.61,73.5 64.01,73.5 62.52,72.01 62.52,70.75 62.29,70.52 59.21,70.52 58.86,70.87 58.86,71.78 53.03,77.61 49.95,77.61 LED4.A
N$6
  Top 0.254: R7.2 65.95,71.44 64.12,69.61 57.84,69.61 57.38,69.15 56.69,69.15 53.26,72.58 52.92,72.58 LED5.A
N$8
  Top 0.254: U3.8 10.06,56.35 8.12,56.35 7.09,55.32 D3.C 6.86,55.21 5.71,54.06 L2.1
N$9  (via drill 0.5)
  Top 0.254: v66.64,68.92 66.64,67.67 R8.2 | v64.12,74.3 59.32,74.3 53.84,79.78 LED6.A
  Bottom 0.254: v66.64,68.92 66.64,71.78 v64.12,74.3
N$10
  Top 0.254: R10.2 54.63,58.86 54.63,53.72 52.46,51.55 52.46,49.95 T1.3
N$16  (via drill 0.5)
  Top 0.254: v52.23,72.12 52.23,70.41 55.66,66.98 57.04,66.98 57.95,67.89 R4.2 | v51.21,81.15 50.63,81.15 49.95,81.84 LED2.A
  Bottom 0.254: v52.23,72.12 52.23,80.12 v51.21,81.15
N$17
  Top 0.254: R3.2 57.95,71.21 56.12,73.04 53.15,73.04 50.98,75.21 50.98,76.24 50.52,76.69 49.15,76.69 48.92,76.92 48.92,82.98 49.84,83.9 LED1.A
R1G
  Bottom 3: K101.11 67.31,19.08 67.31,5.71 67.86,5.16 X5.3
R1NC
  Bottom 3: K101.12 62.69,19.68 62.87,19.68 X5.2
R1NO
  Top 3: K101.14 57.87,14.98 X5.1
  Bottom 3: K101.14 57.78,14.9 57.78,14.61 57.78,5.14 X5.1
R2G
  Bottom 3: K201.11 83.19,17.81 83.19,5.14 X6.3
R2NC
  Bottom 3: 73.72,23.2 K201.12 77.29,19.68 77.47,19.68 77.47,17.78 78.11,17.14 X6.2
R2NO
  Bottom 3: K201.14 73.03,15.54 73.03,5.14 X6.1
R3G
  Bottom 3: X7.3 98.34,17.25 K301.11
R3NC
  Bottom 3: K301.12 92.08,19.5 92.08,17.78 93.34,16.51 X7.2
R3NO
  Bottom 3: K301.14 88.3,5.11 X7.1
R4G
  Bottom 3: X13.3 88.34,66.67 K401.11
R4NC
  Bottom 3: X13.2 93.34,73.66 92.08,72.39 92.08,67.94 95.89,64.14 95.89,63.1 K401.12
R4NO
  Bottom 3: K401.14 95.86,70.45 98.42,73.03 98.42,81.22 X13.1
RD+  (via drill 0.5)
  Top 0.254: v49.38,69.04 49.38,68.01 RN1.1 | v40.92,45.15 40.92,44.01 39.89,42.98 39.89,42.63 40.35,42.18 43.55,42.18 43.66,42.29 44.23,42.29 U1.4
  Route2 0.254: v49.38,69.04 42.18,61.84 42.18,54.75 42.29,54.63 42.29,46.52 v40.92,45.15
RD-
  Top 0.254: RN1.2 49.06,67.58 49.06,67.31 49.46,67.31 50.13,67.31 51.37,67.31 52.52,67.23 52.53,67.17 52.8,67 52.84,66.94 53.35,66.1 53.65,65.83 54.04,65.48 54.14,65.39 54.38,65.18 55.65,64.17 55.9,63.95 56.28,63.61 56.41,63.49 56.42,63.48 55.34,63.03 54.97,62.76 54.8,62.66 54.45,62.45 54.28,62.35 54.16,62.29 53.8,62 53.71,61.91 53.56,61.25 53.56,61.04 53.56,60.36 53.56,60.12 53.56,59.76 53.56,59.63 53.56,59.13 53.56,59.01 53.56,58.4 53.56,58.17 53.56,56.56 53.56,55.84 53.57,54.4 53.58,54.39 53.26,54.55 52.78,54.45 52.59,54.41 52.19,54.35 52,54.32 51.72,54.29 51.18,54.04 50.89,54.05 50.49,54.01 50.1,53.96 49.7,53.94 48.9,53.8 48.09,53.67 47.4,53.48 47.08,53.33 46.7,53.14 45.9,52.71 45.78,52.65 45.09,52.62 45.06,52.61 44.57,52.07 44.03,51.12 43.86,50.8 43.69,50.48 43.52,50.12 43.37,49.79 43.47,49.61 43.81,49.02 44.16,48.42 44.62,47.77 44.83,47.31 44.91,47.14 45.03,46.87 45.11,46.49 45.2,46.19 45.2,46.16 45.12,46.09 45.09,46.05 45,45.96 44.71,45.59 44.55,45.31 44.51,45.24 44.42,45.1 44.16,44.78 44.14,44.76 43.81,44.76 43.8,44.76 43.47,44.73 43.35,44.7 43.16,44.67 42.87,44.5 42.52,44.24 42.16,43.98 42.08,43.9 41.94,43.77 41.79,43.65 41.64,43.52 41.29,43.27 40.92,43.02 40.49,42.77 U1.3
RELAY1:N$1  (via drill 0.5)
  Top 0.254: 59.09,44.01 60.58,44.01 60.92,44.35 D102.A | 59.09,44.01 57.84,44.01 Q101.D | v52.69,3.2 51.66,2.17 LED101.C | v59.09,43.89 59.09,44.01
  Bottom 0.254: v52.69,3.2 52.69,33.6 58.98,39.89 K101.A1 59.09,40.01 v59.09,43.89
RELAY1:N$2  (via drill 0.5)  (1 unrouted)
  Top 0.254: v66.52,48.46 65.15,49.84 62.98,49.84 61.49,48.35 R102.1 | v55.09,2.74 54.41,2.74 53.84,2.17 LED101.A
  Bottom 0.254: 66.98,48.46 v66.52,48.46 | 54.29,14.86 54.29,3.54 v55.09,2.74
RELAY1:N$4
  Top 0.254: R101.2 58.64,48.23 58.64,46.29 Q101.G
RELAY2:N$1  (via drill 0.5)  (1 unrouted)
  Top 0.254: Q201.D 68.58,44.01 71.32,44.01 71.67,44.35 D202.A 71.32,43.89 v71.32,42.98 | v48.92,3.2 50.52,3.2 50.98,3.66 50.98,3.77 51.55,4.34 LED201.C
  Bottom 0.254: v48.92,3.2 51.55,3.2 52.35,2.4 53.03,2.4 53.84,3.2 53.84,21.37 | K201.A1 73.61,39.89 72.35,39.89 72.35,40.01 71.32,41.03 v71.32,42.98
RELAY2:N$2  (via drill 0.5)  (1 unrouted)
  Top 0.254: v71.09,47.21 72.12,48.23 R202.1 | v55.09,3.89 54.29,3.89 53.84,4.34 LED201.A
  Bottom 0.254: 71.09,45.03 v71.09,47.21 | v55.09,3.89 55.09,5.03
RELAY2:N$4
  Top 0.254: R201.2 69.49,48.23 69.49,46.29 Q201.G
RELAY3:N$1  (1 unrouted)
  Top 0.254: Q301.D 83.55,47.55 83.21,47.21 83.21,44.46 D302.A 83.33,44.46 83.55,44.46 88.12,39.89 K301.A1 88.24,39.89 | 54.63,5.49 53.38,5.49 52.12,6.74 51.66,6.74 LED301.C
RELAY3:N$2  (1 unrouted)
  Top 0.254: 82.64,39.43 82.64,40.46 82.07,41.03 82.07,45.26 82.53,45.72 82.53,49.26 81.61,50.18 77.27,50.18 76.01,51.44 R302.1 | 53.84,6.86 LED301.A
RELAY3:N$4
  Top 0.254: R301.2 78.98,48.35 81.27,48.35 81.38,48.46 Q301.G
RELAY4:N$1
  Top 0.254: 84.35,54.86 85.61,56.12 85.61,61.61 81.84,65.38 81.84,80.24 78.64,83.44 77.61,83.44 76.81,82.64 76.81,82.3 73.61,79.1 57.38,79.1 53.84,82.64 53.84,84.01 LED401.C | 84.35,54.86 83.9,54.86 Q401.D | 84.35,54.86 84.35,51.44 D402.A 84.47,51.32 85.38,51.32 90.18,46.52 95.78,46.52 K401.A1
RELAY4:N$2  (via drill 0.5)
  Top 0.254: v70.07,68.12 70.07,64.92 78.52,56.46 78.52,55.32 R402.1 | v52.01,82.75 52.01,83.67 51.66,84.01 LED401.A
  Route2 0.254: v70.07,68.12 64.69,73.5 62.52,73.5 61.04,74.98 59.78,74.98 v52.01,82.75
RELAY4:N$4
  Top 0.254: R401.2 84.7,59.66 84.7,57.04 Q401.G
RESET  (via drill 0.5)
  Top 0.254: 40.8,60.58 40.01,60.58 39.09,61.49 S1.1 38.98,61.49 32.12,61.49 S1.2 32,61.49 31.32,60.81 28.8,60.81 D1.A | 40.8,60.58 42.06,60.58 42.52,61.04 42.52,61.27 R1.2 | v45.61,36.69 45.61,37.83 U1.13 | v40.8,53.61 40.8,60.58
  Route15 0.254: v45.61,36.69 45.61,44.58 39.43,50.75 JP1.5
  Bottom 0.254: v40.8,53.61 40.8,52.23 JP1.5
RS485A1
  Top 0.254: 19.09,72.12 17.95,72.12 IC1001.7 | 19.09,72.12 19.89,72.12 D1001.2 | 19.09,72.12 19.09,80.7 18.52,81.27 X9.3
RS485A2
  Top 0.254: D1101.2 22.06,70.87 24,70.87 24.23,71.09 IC1101.7 24.35,71.09 24.8,71.09 28.46,74.75 28.46,81.27 X9.1
RS485B1
  Top 0.254: D1001.1 20,73.95 20,73.5 20.8,72.69 20.8,71.55 20.46,71.21 17.72,71.21 IC1001.6 17.6,71.21 17.03,71.21 13.26,74.98 13.26,81.27 X8.1
RS485B2  (via drill 0.5)
  Top 0.254: v23.2,68.81 22.06,68.81 D1101.1 | IC1101.6 24.23,72.47 23.55,72.47 22.86,73.15 22.86,80.7 23.43,81.27 X9.2
  Bottom 0.254: v23.2,68.81 23.2,81.04 23.43,81.27 X9.2
RXLED/SS  (1 unrouted)
S11
  Top 0.254: B501.AC1 3.44,12 3.44,11.2 7.67,6.97 X2.2
S12
  Top 0.254: 3.44,14.52 B501.AC2 2.54,14.61 1.27,13.34 1.27,7.04 X2.1 3.31,5.03
S21
  Top 0.254: X3.1 18.5,5.18 11.67,12 B601.AC1
S22
  Top 0.254: B601.AC2 11.56,14.52 11.56,13.72 10.53,12.69 10.53,7.76 13.14,5.14 X2.3
S31
  Top 0.254: B701.AC1 19.9,12 22.87,12 27.57,7.3 X3.3
S32
  Top 0.254: B701.AC2 19.79,14.52 19.21,14.52 17.61,12.92 16.82,12.92 16.59,12.69 16.59,11.43 18.53,9.49 19.77,9.49 23.43,5.83 23.43,5.14 X3.2
S41
  Top 0.254: X4.2 38.73,5.74 32.47,12 28.13,12 B801.AC1
S42
  Top 0.254: B801.AC2 28.02,14.52 27.45,14.52 25.84,12.92 25.04,12.92 24.82,12.69 24.82,11.43 29.05,7.2 31.66,7.2 33.72,5.14 X4.1
SCK  (via drill 0.5)
  Top 0.254: v43.09,40.35 43.66,39.78 44.23,39.78 U1.9 | v39.78,45.15 39.78,46.75 36.92,49.61 36.92,50.75 JP1.3
  Bottom 0.254: v43.09,40.35 43.09,40.58 39.78,43.89 v39.78,45.15
SENSE1:N$2  (via drill 0.5)  (2 unrouted)
  Top 0.254: v4.8,30.86 3.89,29.95 R503.1 | 55.32,1.14 50.75,1.14 49.95,1.94 LED501.A
  Bottom 0.254: v4.8,30.86 5.37,30.86 32.46,3.77 32.46,3.66 34.75,1.37 55.55,1.37
  other vias: 56.24,2.06
SENSE1:N$3
  Top 0.254: B501.+ 9.38,12.12 9.38,12.92 10.53,14.06 10.53,16.12 12.13,17.72 R501.1
SENSE1:N$4
  Top 0.254: OK501.1 2.63,20.69 2.97,20.69 4.12,21.83 6.06,21.83 6.4,21.49 6.4,19.09 7.66,17.83 8.12,17.83 8.22,17.78 R501.2
SENSE1:N$5
  Top 0.254: OK501.2 5.08,19.36 3.6,17.88 R502.2
SENSE1:N$6
  Top 0.254: B501.- 9.27,14.63 9.27,14.97 6.53,17.72 R502.1
SENSE1:N$10
  Top 0.254: 5.26,28.92 5.26,27.77 5.14,27.66 OK501.3 | 5.26,28.92 5.26,29.83 R504.1 | 5.26,28.92 3.09,28.92 2.17,29.83 R503.2 2.17,29.95 2.63,30.4 2.63,34.86 C501.+
SENSE2:N$2  (via drill 0.5)
  Top 0.254: v7.89,31.09 7.89,29.95 R603.1 | v41.5,12.57 48.82,5.26 48.92,5.26 49.84,4.34 LED601.A
  Bottom 0.254: v7.89,31.09 8.81,31.09 27.33,12.57 v41.5,12.57
SENSE2:N$3
  Top 0.254: B601.+ 17.61,12.12 18.19,12.12 19.79,13.72 20.7,13.72 23.56,16.57 23.56,17.72 R601.1
SENSE2:N$4
  Top 0.254: OK601.1 8.34,20.69 10.06,22.4 10.06,22.52 10.52,22.97 11.2,22.97 12.69,21.49 12.69,21.04 14.64,19.09 19.44,19.09 20.7,17.83 R601.2
SENSE2:N$5  (via drill 0.5)
  Top 0.254: v10.86,22.17 10.86,20.69 OK601.2 | v14.53,16.12 14.53,17.26 14.99,17.72 R602.2
  Bottom 0.254: v10.86,22.17 12.13,20.9 12.13,18.52 v14.53,16.12
SENSE2:N$6
  Top 0.254: B601.- 17.61,14.63 17.61,17.49 17.84,17.72 R602.1
SENSE2:N$10
  Top 0.254: 10.74,29.95 9.6,29.95 R603.2 | 10.74,29.95 10.97,29.95 R604.1 10.97,30.06 10.97,34.86 C601.+ | 10.74,29.95 10.74,27.66 OK601.3
SENSE3:N$2  (via drill 0.5)
  Top 0.254: v14.74,31.09 13.6,29.95 R703.1 | v46.52,16.46 46.52,16 50.98,11.54 50.98,7.89 49.84,6.74 LED701.A
  Bottom 0.254: v14.74,31.09 17.95,31.09 26.75,22.29 40.69,22.29 v46.52,16.46
SENSE3:N$3
  Top 0.254: B701.+ 25.96,12.12 26.53,12.12 28.13,13.72 30.99,13.72 34.99,17.72 R701.1
SENSE3:N$4  (via drill 0.5)
  Top 0.254: v17.95,21.83 15.54,21.83 14.4,20.69 14.06,20.69 OK701.1 | v28,20.69 29.27,20.69 32.13,17.83 R701.2
  Bottom 0.254: v17.95,21.83 26.86,21.83 v28,20.69
SENSE3:N$5
  Top 0.254: OK701.2 16.57,20.57 19.44,20.57 20.93,19.09 25.16,19.09 26.42,17.83 R702.2
SENSE3:N$6
  Top 0.254: B701.- 25.96,14.63 26.19,14.63 29.27,17.72 R702.1
SENSE3:N$10
  Top 0.254: 16.46,29.95 15.32,29.95 R703.2 | 16.46,29.95 16.69,29.95 R704.1 16.69,30.06 16.69,32.35 19.2,34.86 C701.+ | 16.46,29.95 16.46,27.66 OK701.3
SENSE4:N$2  (via drill 0.5)
  Top 0.254: v45.61,13.26 36.46,22.4 25.95,22.4 21.6,26.75 21.6,28.57 21.37,28.8 20.34,28.8 19.32,29.83 R803.1 | v48.58,10.29 49.84,9.03 LED801.A
  Bottom 0.254: v48.58,10.29 v45.61,13.26
SENSE4:N$3
  Top 0.254: B801.+ 34.19,12.12 36.59,12.12 R801.1
SENSE4:N$4
  Top 0.254: OK801.1 20.34,20.69 20.69,20.69 21.95,21.95 34.42,21.95 40.7,15.66 40.7,13.26 39.56,12.12 R801.2
SENSE4:N$5
  Top 0.254: OK801.2 22.86,20.69 26.86,20.69 27.66,21.49 31.1,21.49 33.5,19.09 36.02,19.09 39.45,15.66 39.45,14.63 R802.2
SENSE4:N$6
  Top 0.254: B801.- 34.19,14.63 36.59,14.63 R802.1
SENSE4:N$10
  Top 0.254: R804.1 22.4,29.95 21.03,29.95 R803.2 | R804.1 22.52,29.83 22.52,28 22.86,27.66 OK801.3 | C801.+ 27.43,34.86 27.2,34.86 22.4,30.06 R804.1
TXLED  (via drill 0.5)
  Top 0.254: v53.95,39.43 52.46,37.95 50.18,37.95 U1.22 | v64.35,72.69 64.35,71.55 R7.1
  Route2 0.254: v53.95,39.43 53.95,41.72 64.35,52.12 v64.35,72.69
UCAP
  Top 0.254: C5.1 41.15,35.89 41.15,38.52 40.69,38.98 40.69,39.78 42.18,41.26 44.23,41.26 U1.6
VUSB  (via drill 0.5)  (2 unrouted)
  Top 0.254: v54.41,60.92 54.06,60.58 54.06,58.41 54.18,58.29 54.18,54.29 51.55,51.66 51.55,47.89 T1.1 | v52.69,60.92 52.69,59.89 R2.2 52.81,59.78 51.21,59.78 50.86,59.44 C9.1 50.75,59.44 50.06,58.75 48.92,58.75 C8.+
  Bottom 0.254: v52.69,60.92 v54.41,60.92
XTAL1
  Top 0.254: C2.2 50.68,35.37 50.61,35.22 X1.3 49.23,35.4 48.49,36.4 48.49,36.44 48.26,36.51 48.25,36.51 48.19,36.52 48.11,36.77 48.04,36.79 47.97,36.8 47.75,36.81 47.69,36.81 47.62,37.25 U1.17
XTAL2
  Top 0.254: U1.16 47.12,36.58 47.25,36.58 47.38,36.59 47.5,36.58 47.56,36.58 47.69,36.35 47.75,36.35 47.9,36.35 47.96,36.34 48.01,36.33 48.09,36.08 48.14,36.07 48.13,36.07 48.03,36.44 48.03,36.4 48.26,35.79 48.26,35.22 48.26,34.29 48.03,34.29 X1.1 45.99,33.37 45.99,33.33 C1.2